# Altium schematic sheet IOs.DMX8x8A.SchDoc: DMX8x8A-v1
size A; ApprovedBy: Фамилия4; CheckedBy: Фамилия2; Author: Фамилия1; DocumentNumber: 2; SheetNumber: 2; SheetTotal: 2; NormInspection: Фамилия3; DocumentType1str: Схема; DocumentType2str: электрическая принципиальная
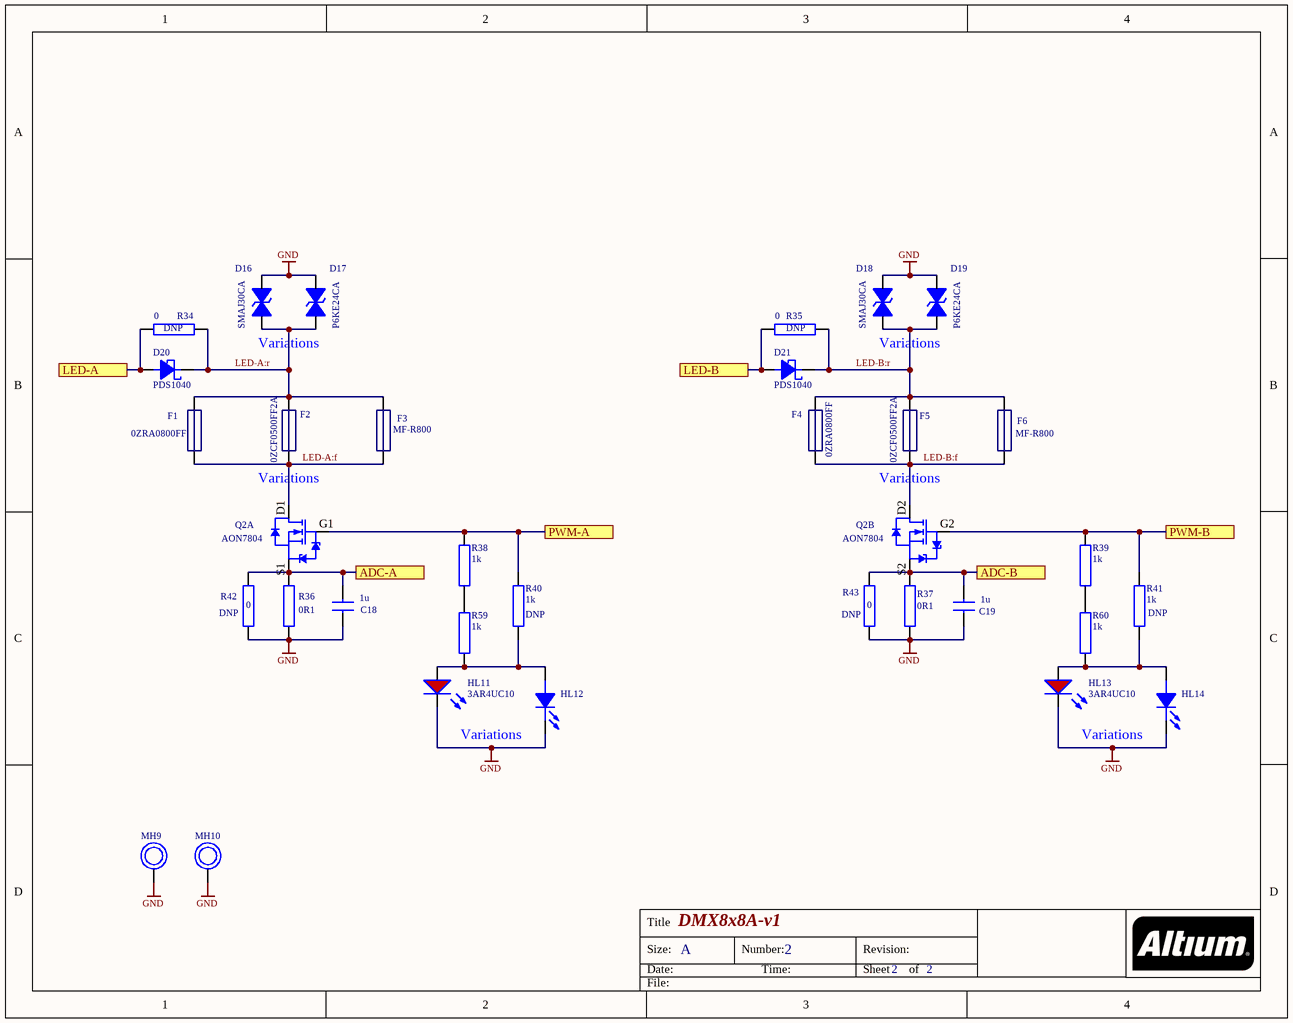
[diagram p0: IOs.DMX8x8A.SchDoc]

## Parts
C18  value 1u  [Chip C 0402 - 1206]  (hidden comment: 1u 50V 5%)
C19  value 1u  [Chip C 0402 - 1206]  (hidden comment: 1u 50V 5%)
D16  SMAJ30CA  [DO-214AC (SMA) biplar]
D17  P6KE24CA  [DIOAD1910W90L670D310 (DO-15)]
D18  SMAJ30CA  [DO-214AC (SMA) biplar]
D19  P6KE24CA  [DIOAD1910W90L670D310 (DO-15)]
D20  PDS1040  [PDS1040]
D21  PDS1040  [PDS1040]
F1  0ZRA0800FF  [0ZRA0800FF]
F2  0ZCF0500FF2A  [0ZCF0500FF2A]
F3  MF-R800  [MF-R800]
F4  0ZRA0800FF  [0ZRA0800FF]
F5  0ZCF0500FF2A  [0ZCF0500FF2A]
F6  MF-R800  [MF-R800]
HL11  3AR4UC10  [LED-2pin 2.54mm]
HL12  ? Any  [LED SMD 0805]  (value not drawn)
HL13  3AR4UC10  [LED-2pin 2.54mm]
HL14  ? Any  [LED SMD 0805]  (value not drawn)
MH9  PMH  [Hole Pad 3.2x4mm]  (value not drawn)  (no BOM)
MH10  PMH  [Hole Pad 3.2x4mm]  (value not drawn)  (no BOM)
Q2  AON7804  [AON7804]  (parts A,B of 2)
R34  value 0  [Chip R 0402 - 1206]  (hidden comment: 0 5%)
R35  value 0  [Chip R 0402 - 1206]  (hidden comment: 0 5%)
R36  value 0R1  [RES7W]  (hidden comment: KNP700JB-91-0R1)
R37  value 0R1  [RES7W]  (hidden comment: KNP700JB-91-0R1)
R38  value 1k  [Chip R 0402 - 1206]  (hidden comment: 1k 5%)
R39  value 1k  [Chip R 0402 - 1206]  (hidden comment: 1k 5%)
R40  value 1k  [Chip R 0402 - 1206]  (hidden comment: 1k 5%)
R41  value 1k  [Chip R 0402 - 1206]  (hidden comment: 1k 5%)
R42  value 0  [Chip R 0402 - 1206]  (hidden comment: 0 5%)
R43  value 0  [Chip R 0402 - 1206]  (hidden comment: 0 5%)
R59  value 1k  [Chip R 0402 - 1206]  (hidden comment: 1k 5%)
R60  value 1k  [Chip R 0402 - 1206]  (hidden comment: 1k 5%)

## Ports
ADC-A, ADC-B, LED-A, LED-B, PWM-A, PWM-B

## Nets
GND: C18.1 C19.1 D16.1 D17.1 D18.1 D19.1 HL11.2 HL12.2(K) HL13.2 HL14.2(K) MH9.1 MH10.1 R36.1 R37.1 R42.1 R43.1
ADC-A: C18.2 Q2.S1 R36.2 R42.2 ; port ADC-A
ADC-B: C19.2 Q2.S2(S1) R37.2 R43.2 ; port ADC-B
LED-A: D20.1(A) R34.2 ; port LED-A
LED-A:f: F1.1 F2.1 F3.1 Q2.D1
LED-A:r: D16.2 D17.2 D20.2(K) F1.2 F2.2 F3.2 R34.1
LED-B: D21.1(A) R35.2 ; port LED-B
LED-B:f: F4.1 F5.1 F6.1 Q2.D2
LED-B:r: D18.2 D19.2 D21.2(K) F4.2 F5.2 F6.2 R35.1
PWM-A: Q2.G1 R38.1 R40.1 ; port PWM-A
PWM-B: Q2.G2(G1) R39.1 R41.1 ; port PWM-B
NetHL11_1: HL11.1 HL12.1(A) R40.2 R59.2
NetHL13_1: HL13.1 HL14.1(A) R41.2 R60.2
NetR38_2: R38.2 R59.1
NetR39_2: R39.2 R60.1

## Notes on the sheet
- Variations
- (near HL12) Variations
- (near HL14) Variations
- Title
- Size:
- Date:
- A
- Number:
- Time:
- Revision:
- Sheet
- of
- File:

## Library data of the parts
C18 C19 = Ceramic SMD Cap_R: Ceramic Chip Capacitor; Value2: 50V 5%; SMD/TH: SMD; ComponentLink1Description: Local Datasheet; ComponentLink1URL: V:\Libraries\Passives\RLC\Capacitors\AVXShortForm.pdf; HelpURL: https://www.mouser.com/catalog/supplier/library/AVXShortForm.pdf; Footprint: =copy(currentfootprint,2,4)
D16 D18 = SMAJ30CA: TVS Uni 30V; Mfr: ST; DNP: D16; SMD/TH: SMD; HelpURL: https://www.st.com/resource/en/datasheet/smaj.pdf; ComponentLink1Description: Local Datasheet; ComponentLink1URL: V:\Libraries\Discrete\TVS\1724007.pdf
D17 D19 = P6KE: TVS Axial 600W Unipolar 24V; SMD/TH: TH; DNP: D16; HelpURL: https://m.littelfuse.com/~/media/electronics/datasheets/tvs_diodes/littelfuse_tvs_diode_p6ke_datasheet.pdf.pdf
D20 D21 = PDS1040: 10A SCHOTTKY BARRIER RECTIFIER; Mfr: DIODES INC.; HelpURL: https://www.diodes.com/assets/Datasheets/Ds30538.pdf
F1 F4 = 0ZRA: Radial Leaded PTC 8/13.6A; SMD/TH: TH; DNP: F1; IH/IT: 5/13.6A; HelpURL: https://www.belfuse.com/resources/datasheets/circuitprotection/ds-cp-0zra-series.pdf
F2 F5 = 0ZCF0500FF2A: Surface Mount PTC 5/10A; SMD/TH: SMD; DNP: F1; IH/IT: 5/10; HelpURL: https://www.belfuse.com/resources/datasheets/circuitprotection/ds-cp-0zcf-series.pdf
F3 F6 = MF-R800: PTC Resettable Fuse 8/16A; SMD/TH: TH; DNP: F1; HelpURL: https://www.bourns.com/docs/Product-Datasheets/mfr.pdf; IH/IT: 8/16A
HL11 = 3AR4UC10: LED 3mm Red; SMD/TH: TH; DNP: HL11; HelpURL: http://www.triatron.ru/upload/catalog_photo/elements/pdf/006531.pdf
HL12 = LED 0805: SMD/TH: SMD; DNP: HL11; PN: ?; Color: Any
HL13 = 3AR4UC10: LED 3mm Red; SMD/TH: TH; DNP: HL13; HelpURL: http://www.triatron.ru/upload/catalog_photo/elements/pdf/006531.pdf
HL14 = LED 0805: SMD/TH: SMD; DNP: HL13; PN: ?; Color: Any
MH9 MH10 = PMH: Plated Mounting Hole
Q2 = AON7804: 30V Dual N-Channel MOSFET; SMD/TH: SMD; HelpURL: http://aosmd.com/res/data_sheets/AON7804.pdf; ComponentLink1Description: Drawing; ComponentLink1URL: http://aosmd.com/res/packaging_information/DFN3x3_8L_EP2_P.pdf
R34 R35 R38-R43 R59 R60 = SMD Res_R: Chip Resistor; HelpURL: http://www.vishay.com/docs/49252/_dbr_smd_resistor_product_overview_vmn_sg2189_1705.pdf; ComponentLink1Description: Local Datasheet; ComponentLink1URL: V:\Libraries\Passives\Resistors\_dbr_smd_resistor_product_overview_vmn_sg2189_1705.pdf; Value2: 5%; Footprint: =copy(currentfootprint,2,4)
  R34 R35 R40-R43: DNP: DNP
R36 R37 = Res 7W: Resistor 7W Axial; Mfr: Yageo; SMD/TH: TH; HelpURL: https://www.yageo.com/upload/media/product/products/datasheet/lr/Yageo_LR_KNP_1.pdf